# Altium schematic sheet Memory.SchDoc
size A3; SheetNumber: 3; SheetTotal: 6
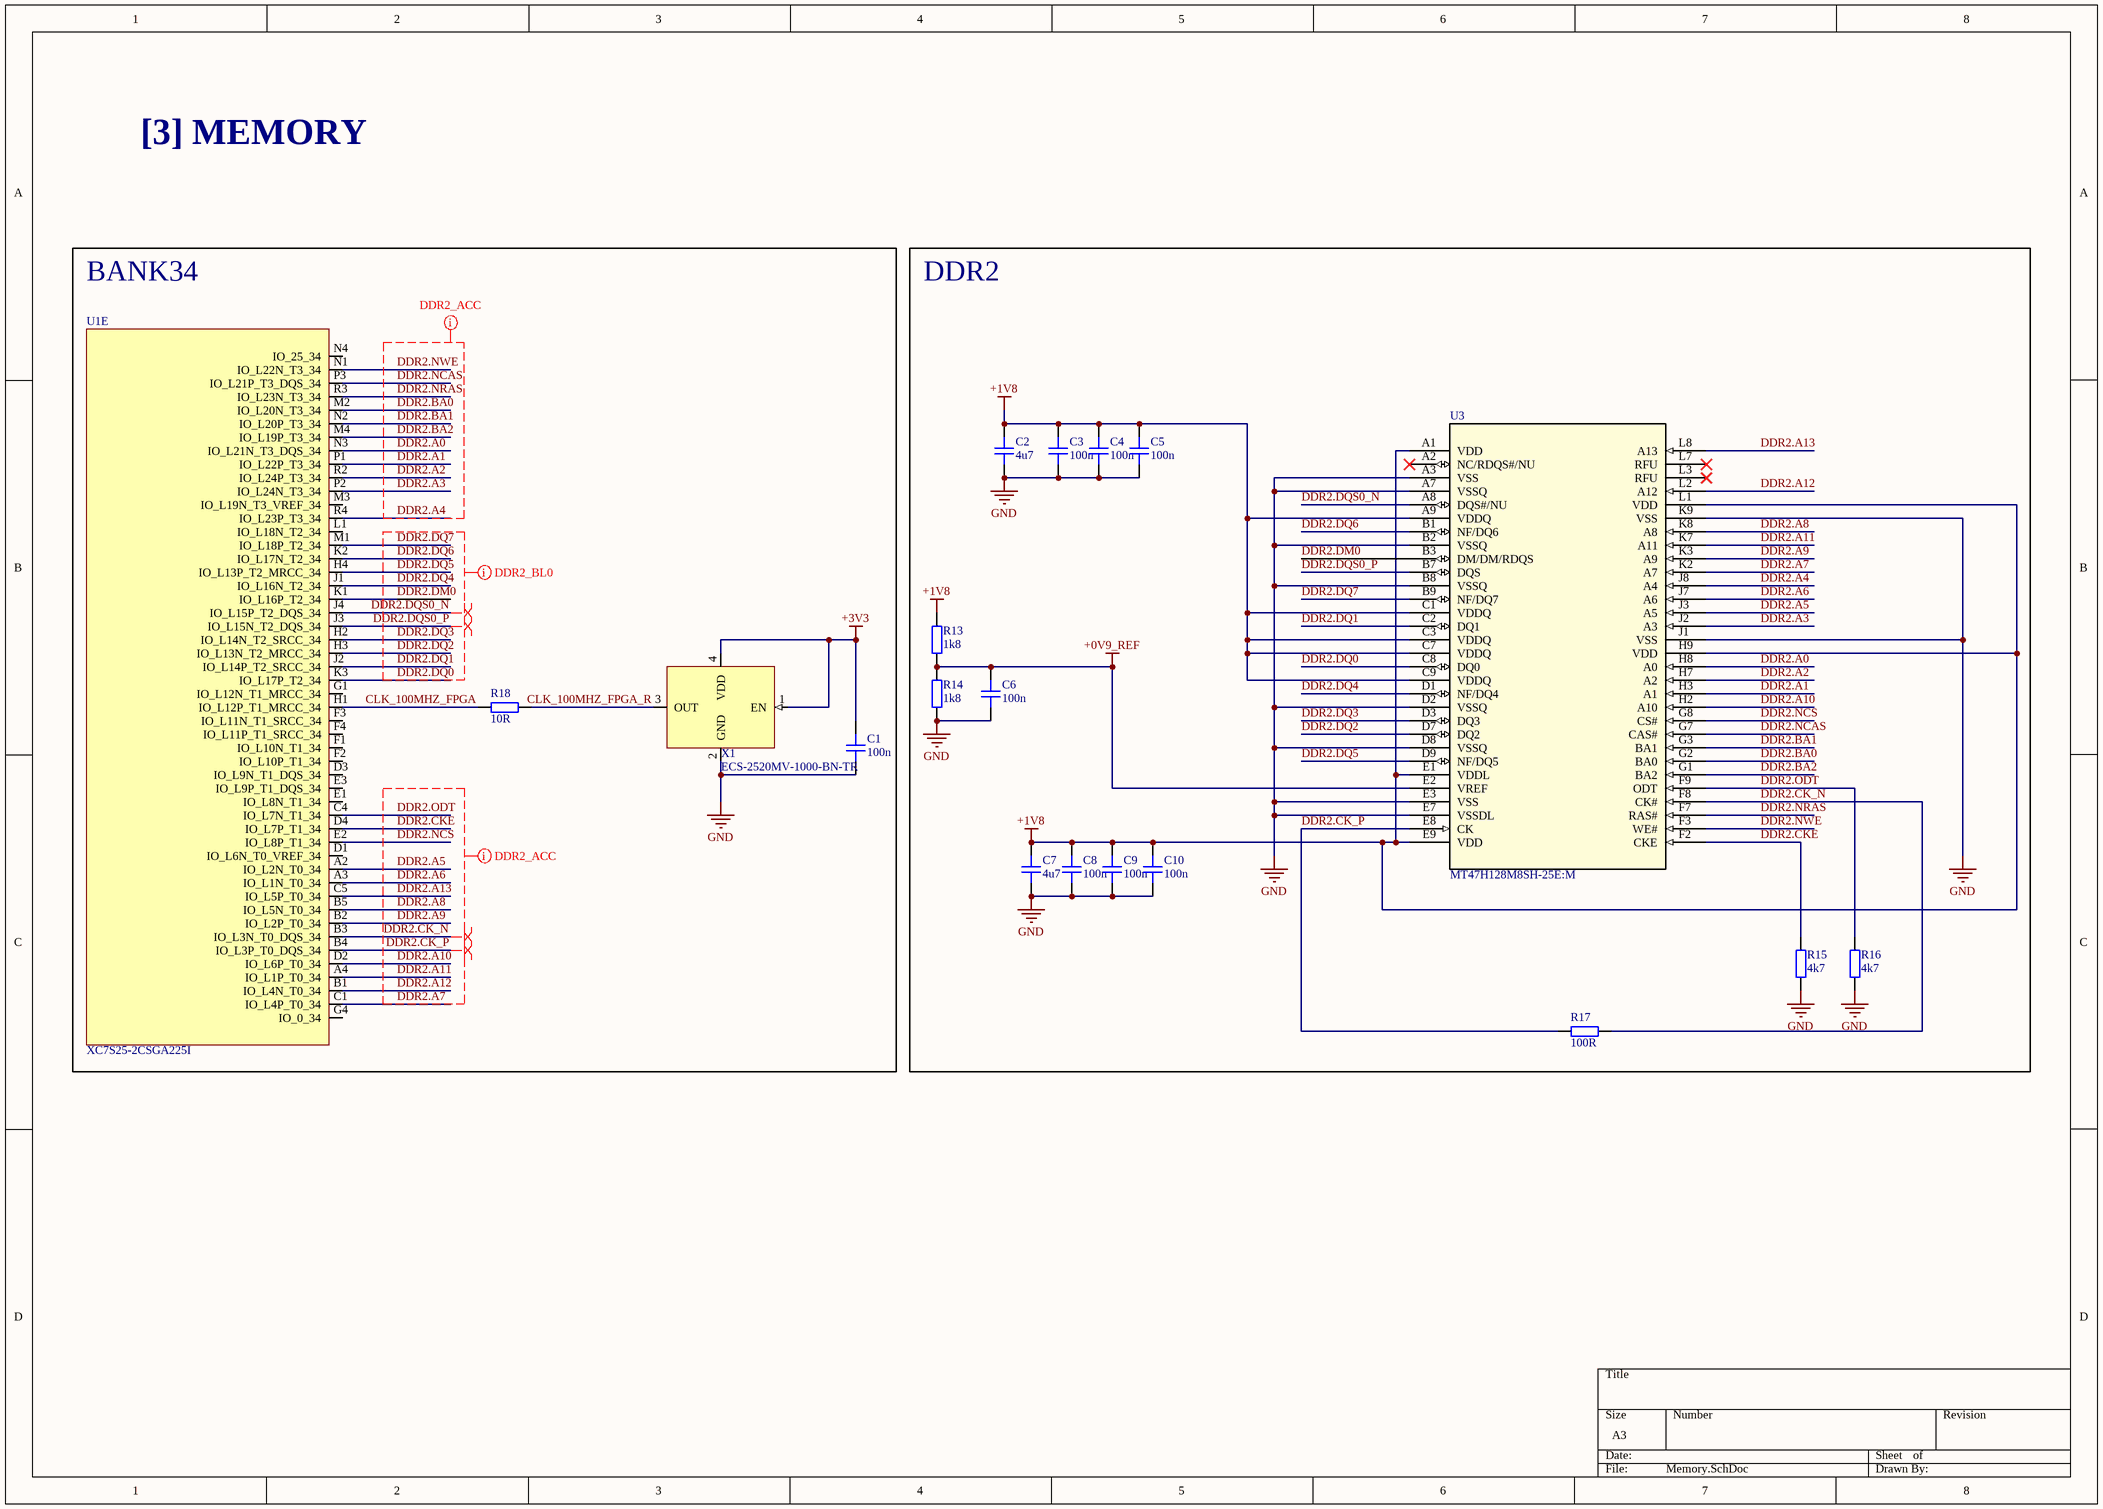
[diagram p0: Memory.SchDoc]

## Parts
C1  100n  [CAP_0402]
C2  4u7  [CAP_0402]
C3  100n  [CAP_0402]
C4  100n  [CAP_0402]
C5  100n  [CAP_0402]
C6  100n  [CAP_0201]
C7  4u7  [CAP_0402]
C8  100n  [CAP_0402]
C9  100n  [CAP_0402]
C10  100n  [CAP_0402]
R13  1k8  [RES_0201]
R14  1k8  [RES_0201]
R15  4k7  [RES_0402]
R16  4k7  [RES_0402]
R17  100R  [RES_0201]
R18  10R  [RES_0402]
U1  XC7S25-2CSGA225I  [CSGA225]  (part E of 5)
U3  MT47H128M8SH-25E:M  [FBGA60_8X10_MRN]
X1  ECS-2520MV-1000-BN-TR  [XTAL_2520]

## Blocks framed on the sheet
BANK34: C1 R18 U1 X1
DDR2: C2-C10 R13-R17 U3

## Nets
+0V9_REF: C6.2 R13.1 R14.2 U3.E2(VREF)
+1V8: C2.2 C3.2 C4.2 C5.2 C7.2 C8.2 C9.2 C10.2 R13.2 U3.A1(VDD) U3.A9(VDDQ) U3.C1(VDDQ) U3.C3(VDDQ) U3.C7(VDDQ) U3.C9(VDDQ) U3.E1(VDDL) U3.E9(VDD) U3.H9(VDD) U3.L1(VDD)
+3V3: C1.2 X1.1(EN) X1.4(VDD)
GND: C1.1 C2.1 C3.1 C4.1 C5.1 C6.1 C7.1 C8.1 C9.1 C10.1 R14.1 R15.1 R16.1 U3.A3(VSS) U3.A7(VSSQ) U3.B2(VSSQ) U3.B8(VSSQ) U3.D2(VSSQ) U3.D8(VSSQ) U3.E3(VSS) U3.E7(VSSDL) U3.J1(VSS) U3.K9(VSS) X1.2(GND)
CLK_100MHZ_FPGA: R18.2 U1.H1(IO_L12P_T1_MRCC_34)
CLK_100MHZ_FPGA_R: R18.1 X1.3(OUT)
DDR2.A0: U1.N3(IO_L21N_T3_DQS_34) U3.H8(A0)
DDR2.A1: U1.P1(IO_L22P_T3_34) U3.H3(A1)
DDR2.A2: U1.R2(IO_L24P_T3_34) U3.H7(A2)
DDR2.A3: U1.P2(IO_L24N_T3_34) U3.J2(A3)
DDR2.A4: U1.R4(IO_L23P_T3_34) U3.J8(A4)
DDR2.A5: U1.A2(IO_L2N_T0_34) U3.J3(A5)
DDR2.A6: U1.A3(IO_L1N_T0_34) U3.J7(A6)
DDR2.A7: U1.C1(IO_L4P_T0_34) U3.K2(A7)
DDR2.A8: U1.B5(IO_L5N_T0_34) U3.K8(A8)
DDR2.A9: U1.B2(IO_L2P_T0_34) U3.K3(A9)
DDR2.A10: U1.D2(IO_L6P_T0_34) U3.H2(A10)
DDR2.A11: U1.A4(IO_L1P_T0_34) U3.K7(A11)
DDR2.A12: U1.B1(IO_L4N_T0_34) U3.L2(A12)
DDR2.A13: U1.C5(IO_L5P_T0_34) U3.L8(A13)
DDR2.BA0: U1.M2(IO_L20N_T3_34) U3.G2(BA0)
DDR2.BA1: U1.N2(IO_L20P_T3_34) U3.G3(BA1)
DDR2.BA2: U1.M4(IO_L19P_T3_34) U3.G1(BA2)
DDR2.CK_N: R17.1 U1.B3(IO_L3N_T0_DQS_34) U3.F8(CK#)
DDR2.CK_P: R17.2 U1.B4(IO_L3P_T0_DQS_34) U3.E8(CK)
DDR2.CKE: R15.2 U1.D4(IO_L7P_T1_34) U3.F2(CKE)
DDR2.DM0: U1.K1(IO_L16P_T2_34) U3.B3(DM/DM/RDQS)
DDR2.DQ0: U1.K3(IO_L17P_T2_34) U3.C8(DQ0)
DDR2.DQ1: U1.J2(IO_L14P_T2_SRCC_34) U3.C2(DQ1)
DDR2.DQ2: U1.H3(IO_L13N_T2_MRCC_34) U3.D7(DQ2)
DDR2.DQ3: U1.H2(IO_L14N_T2_SRCC_34) U3.D3(DQ3)
DDR2.DQ4: U1.J1(IO_L16N_T2_34) U3.D1(NF/DQ4)
DDR2.DQ5: U1.H4(IO_L13P_T2_MRCC_34) U3.D9(NF/DQ5)
DDR2.DQ6: U1.K2(IO_L17N_T2_34) U3.B1(NF/DQ6)
DDR2.DQ7: U1.M1(IO_L18P_T2_34) U3.B9(NF/DQ7)
DDR2.DQS0_N: U1.J4(IO_L15P_T2_DQS_34) U3.A8(DQS#/NU)
DDR2.DQS0_P: U1.J3(IO_L15N_T2_DQS_34) U3.B7(DQS)
DDR2.NCAS: U1.P3(IO_L21P_T3_DQS_34) U3.G7(CAS#)
DDR2.NCS: U1.E2(IO_L8P_T1_34) U3.G8(CS#)
DDR2.NRAS: U1.R3(IO_L23N_T3_34) U3.F7(RAS#)
DDR2.NWE: U1.N1(IO_L22N_T3_34) U3.F3(WE#)
DDR2.ODT: R16.2 U1.C4(IO_L7N_T1_34) U3.F9(ODT)

Not connected (* = marked no-connect by the designer): U1 D1(IO_L6N_T0_VREF_34) D3(IO_L9N_T1_DQS_34) E1(IO_L8N_T1_34) E3(IO_L9P_T1_DQS_34) F1(IO_L10N_T1_34) F2(IO_L10P_T1_34) F3(IO_L11N_T1_SRCC_34) F4(IO_L11P_T1_SRCC_34) G1(IO_L12N_T1_MRCC_34) G4(IO_0_34) L1(IO_L18N_T2_34) M3(IO_L19N_T3_VREF_34) N4(IO_25_34); U3 A2(NC/RDQS#/NU)* L3(RFU)* L7(RFU)*

## Layout directives
differential pair: DDR2.CK_N, DDR2.CK_P, DDR2.DQS0_N, DDR2.DQS0_P
net class DDR2_ACC; rule Matched Net Lengths [Delay Tolerance = 20ps]: DDR2.A0, DDR2.A1, DDR2.A2, DDR2.A3, DDR2.A4, DDR2.A5, DDR2.A6, DDR2.A7, DDR2.A8, DDR2.A9, DDR2.A10, DDR2.A11, DDR2.A12, DDR2.A13, DDR2.BA0, DDR2.BA1, DDR2.BA2, DDR2.CK_N, DDR2.CK_P, DDR2.CKE, DDR2.NCAS, DDR2.NCS, DDR2.NRAS, DDR2.NWE, DDR2.ODT
net class DDR2_Bl0; rule Matched Net Lengths [Delay Tolerance = 20ps]: DDR2.DM0, DDR2.DQ0, DDR2.DQ1, DDR2.DQ2, DDR2.DQ3, DDR2.DQ4, DDR2.DQ5, DDR2.DQ6, DDR2.DQ7, DDR2.DQS0_N, DDR2.DQS0_P

## Notes on the sheet
- [3] MEMORY

## Library data of the parts
C1-C5 C7-C10 = CAP_0402: Capacitor SMD 0402; Manufacturer: *; Manufacturer Part Number: *; Distributor Link: *; LCSC: *; Rating: *; Dielectric: *
C6 = CAP_0201: Capacitor SMD 0201; Manufacturer: *; Manufacturer Part Number: *; Distributor Link: *; LCSC: *; Rating: *; Dielectric: *
R13 R14 R17 = RES_0201: Resistor SMD 0201; Manufacturer: *; Manufacturer Part Number: *; Distributor Link: *; LCSC: *
R15 R16 R18 = RES_0402: Resistor SMD 0402; Manufacturer: *; Manufacturer Part Number: *; Distributor Link: *; LCSC: *
U1 = XC7S25-2CSGA225I: Field-Programmable Gate Array FPGA Spartan-7 Series CSGA-225 Speed Grade 2 Industrial Temperature Range; Manufacturer: Xilinx; Manufacturer Part Number: XC7S25-2CSGA225I; Distributor Link: https://www.lcsc.com/product-detail/Programmable-Logic-Device-CPLDs-FPGAs_XILINX-XC7S25-2CSGA225I_C1521711.html; LCSC: C1521711
U3 = MT47H128M8SH-25E:M: No Description Available; Mfr_Name: Micron; RefDes: RefDes; Type: Type
X1 = ECS-2520MV-130-BN-TR: Standard Clock Oscillators XO (Standard),13MHz,Standby (Power Down),CMOS, Multi-Volt,1.6 V 3.6 V,+/-50ppm,-40 C 85 C,6mA,Surface Mount,4-SMD, No Lead,(2.50mm x 2.00mm),(0.80mm); Manufacturer: ECS; Manufacturer Part Number: ECS-2520MV-130-BN-TR